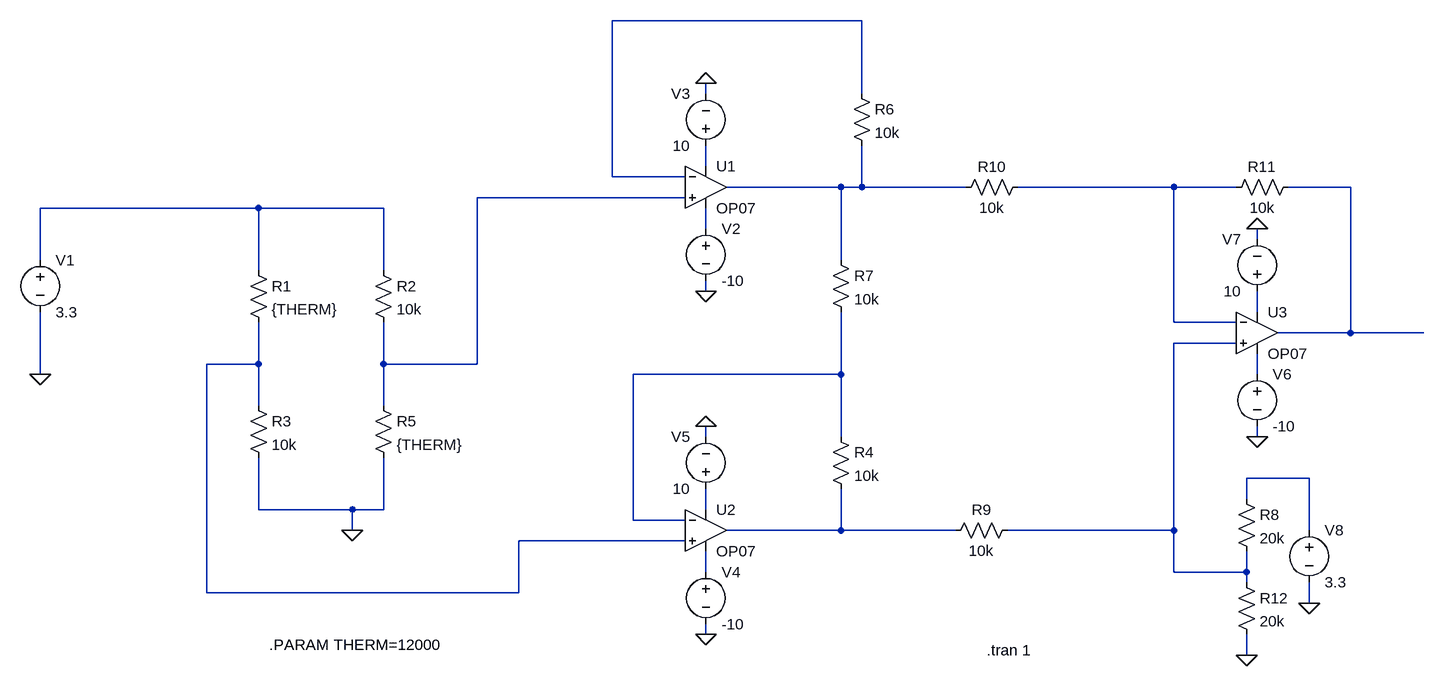
[diagram p0: schematic ThermistorDiagram.asc]
ThermistorDiagram.asc, the LTspice schematic file:
Version 4
SHEET 1 1940 752
WIRE 1072 -240 688 -240
WIRE 832 -128 832 -144
WIRE 1072 -128 1072 -240
WIRE 832 -16 832 -48
WIRE 688 0 688 -240
WIRE 800 0 688 0
WIRE 1040 16 864 16
WIRE 1072 16 1072 -48
WIRE 1072 16 1040 16
WIRE 1232 16 1072 16
WIRE 1552 16 1312 16
WIRE 1648 16 1552 16
WIRE 1824 16 1728 16
WIRE 800 32 480 32
WIRE 144 48 -192 48
WIRE 336 48 144 48
WIRE 832 80 832 48
WIRE 1680 96 1680 80
WIRE -192 128 -192 48
WIRE 1040 128 1040 16
WIRE 144 144 144 48
WIRE 336 144 336 48
WIRE 832 176 832 160
WIRE 1680 208 1680 176
WIRE 1552 224 1552 16
WIRE 1648 224 1552 224
WIRE 1824 240 1824 16
WIRE 1824 240 1712 240
WIRE 1936 240 1824 240
WIRE 1648 256 1552 256
WIRE 144 288 144 224
WIRE 144 288 64 288
WIRE 336 288 336 224
WIRE 480 288 480 32
WIRE 480 288 336 288
WIRE -192 304 -192 208
WIRE 1040 304 1040 208
WIRE 1040 304 720 304
WIRE 1680 304 1680 272
WIRE 144 352 144 288
WIRE 336 352 336 288
WIRE 832 400 832 384
WIRE 1040 400 1040 304
WIRE 1680 400 1680 384
WIRE 1760 464 1664 464
WIRE 1664 496 1664 464
WIRE 144 512 144 432
WIRE 288 512 144 512
WIRE 336 512 336 432
WIRE 336 512 288 512
WIRE 832 512 832 480
WIRE 720 528 720 304
WIRE 800 528 720 528
WIRE 288 544 288 512
WIRE 1040 544 1040 480
WIRE 1040 544 864 544
WIRE 1216 544 1040 544
WIRE 1552 544 1552 256
WIRE 1552 544 1296 544
WIRE 1760 544 1760 464
WIRE 800 560 544 560
WIRE 832 608 832 576
WIRE 1552 608 1552 544
WIRE 1664 608 1664 576
WIRE 1664 608 1552 608
WIRE 1664 624 1664 608
WIRE 64 640 64 288
WIRE 544 640 544 560
WIRE 544 640 64 640
WIRE 1760 656 1760 624
WIRE 832 704 832 688
WIRE 1664 736 1664 704
FLAG -192 304 0
FLAG 288 544 0
FLAG 832 -144 0
FLAG 832 176 0
FLAG 832 384 0
FLAG 832 704 0
FLAG 1680 80 0
FLAG 1680 400 0
FLAG 1664 736 0
FLAG 1760 656 0
SYMBOL res 128 128 R0
SYMATTR InstName R1
SYMATTR Value {THERM}
SYMBOL res 320 128 R0
SYMATTR InstName R2
SYMATTR Value 10k
SYMBOL res 320 336 R0
SYMATTR InstName R5
SYMATTR Value {THERM}
SYMBOL res 128 336 R0
SYMATTR InstName R3
SYMATTR Value 10k
SYMBOL voltage -192 112 R0
SYMATTR InstName V1
SYMATTR Value 3.3
SYMBOL OpAmps/OP07 832 -48 R0
SYMATTR InstName U1
SYMBOL voltage 832 64 R0
SYMATTR InstName V2
SYMATTR Value -10
SYMBOL voltage 832 -32 R180
WINDOW 0 24 96 Left 2
WINDOW 3 24 16 Left 2
SYMATTR InstName V3
SYMATTR Value 10
SYMBOL OpAmps/OP07 832 480 R0
SYMATTR InstName U2
SYMBOL voltage 832 592 R0
SYMATTR InstName V4
SYMATTR Value -10
SYMBOL voltage 832 496 R180
WINDOW 0 24 96 Left 2
WINDOW 3 24 16 Left 2
SYMATTR InstName V5
SYMATTR Value 10
SYMBOL res 1024 384 R0
SYMATTR InstName R4
SYMATTR Value 10k
SYMBOL res 1056 -144 R0
SYMATTR InstName R6
SYMATTR Value 10k
SYMBOL res 1024 112 R0
SYMATTR InstName R7
SYMATTR Value 10k
SYMBOL OpAmps/OP07 1680 176 R0
SYMATTR InstName U3
SYMBOL voltage 1680 288 R0
SYMATTR InstName V6
SYMATTR Value -10
SYMBOL voltage 1680 192 R180
WINDOW 0 24 96 Left 2
WINDOW 3 24 16 Left 2
SYMATTR InstName V7
SYMATTR Value 10
SYMBOL res 1312 528 R90
WINDOW 0 0 56 VBottom 2
WINDOW 3 32 56 VTop 2
SYMATTR InstName R9
SYMATTR Value 10k
SYMBOL res 1328 0 R90
WINDOW 0 0 56 VBottom 2
WINDOW 3 32 56 VTop 2
SYMATTR InstName R10
SYMATTR Value 10k
SYMBOL res 1744 0 R90
WINDOW 0 0 56 VBottom 2
WINDOW 3 32 56 VTop 2
SYMATTR InstName R11
SYMATTR Value 10k
SYMBOL voltage 1760 528 R0
SYMATTR InstName V8
SYMATTR Value 3.3
SYMBOL res 1648 480 R0
SYMATTR InstName R8
SYMATTR Value 20k
SYMBOL res 1648 608 R0
SYMATTR InstName R12
SYMATTR Value 20k
TEXT 1264 728 Left 2 !.tran 1
TEXT 160 720 Left 2 !.PARAM THERM=12000

The netlist it stands for:
* ThermistorDiagram.asc
R1 N007 N011 {THERM}
R2 N007 N006 10k
R5 N006 0 {THERM}
R3 N011 0 10k
V1 N007 0 3.3
XU1 N006 N001 N002 N008 N003 LT1001  ; OP07, pins In+ In- V+ V- OUT
V2 N008 0 -10
V3 N002 0 10
XU2 N011 N012 N015 N017 N016 LT1001  ; OP07, pins In+ In- V+ V- OUT
V4 N017 0 -10
V5 N015 0 10
R4 N012 N016 10k
R6 N001 N003 10k
R7 N003 N012 10k
XU3 N010 N004 N009 N013 N005 LT1001  ; OP07, pins In+ In- V+ V- OUT
V6 N013 0 -10
V7 N009 0 10
R9 N010 N016 10k
R10 N004 N003 10k
R11 N005 N004 10k
V8 N014 0 3.3
R8 N014 N010 20k
R12 N010 0 20k
.tran 1
.PARAM THERM=12000
.lib LTC.lib
.backanno
.end